# EAGLE schematic mini_project (EAGLE 9.5.2)
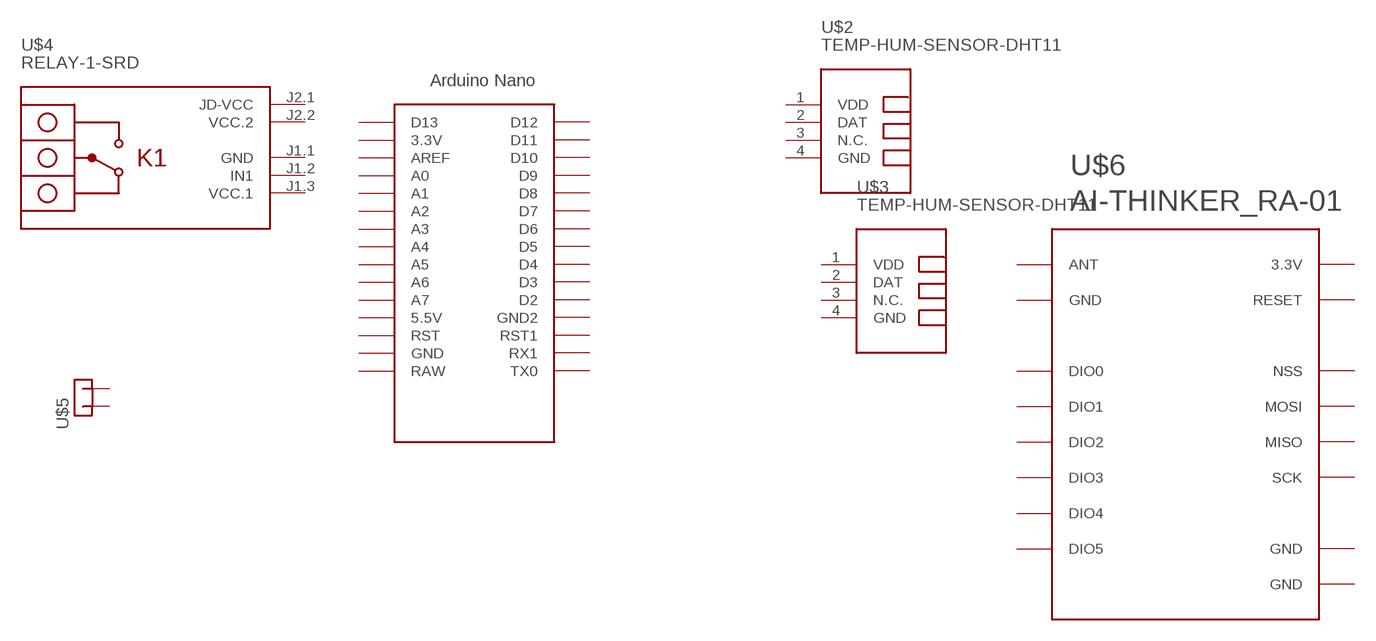
[diagram p0: schematic, sheet 1]

## Parts
U$1  NANO  [NANO]
U$2  TEMP-HUM-SENSOR-DHT11  [TEMP-HUM-SENSOR-DHT11]
U$3  TEMP-HUM-SENSOR-DHT11  [TEMP-HUM-SENSOR-DHT11]
U$4  RELAY-1-SRD  [RELAY-1-SRD]
U$5  -CON2  [CON2]
U$6  AI-THINKER_RA-01  [AI-THINKER_RA-01]
Unconnected: U$1.3.3V U$1.5V(5.5V) U$1.A0 U$1.A1 U$1.A2 U$1.A3 U$1.A4 U$1.A5 U$1.A6 U$1.A7 U$1.AREF U$1.D2 U$1.D3 U$1.D4 U$1.D5 U$1.D6 U$1.D7 U$1.D8 U$1.D9 U$1.D10 U$1.D11 U$1.D12 U$1.D13 U$1.GND U$1.GND1(GND2) U$1.ICSP1 U$1.ICSP2 U$1.ICSP3 U$1.ICSP4 U$1.ICSP5 U$1.ICSP6 U$1.RAW U$1.RST U$1.RST1 U$1.RX1 U$1.TX0 U$2.2(DAT) U$2.3(N.C.) U$3.2(DAT) U$3.3(N.C.) U$4.J1.2(IN1) U$4.J2.1(JD-VCC) U$5.P$1 U$5.P$2 U$6.P$1(ANT) U$6.P$2(GND) U$6.P$3(3.3V) U$6.P$4(RESET) U$6.P$5(DIO0) U$6.P$6(DIO1) U$6.P$7(DIO2) U$6.P$8(DIO3) U$6.P$9(GND) U$6.P$10(DIO4) U$6.P$11(DIO5) U$6.P$12(SCK) U$6.P$13(MISO) U$6.P$14(MOSI) U$6.P$15(NSS) U$6.P$16(GND)

## Power pins joined to a net without a drawn wire
GND: U$2.4(GND) U$3.4(GND) U$4.J1.1(GND)
VCC.1: U$4.J1.3(VCC.1)
VCC.2: U$4.J2.2(VCC.2)
VDD: U$2.1(VDD) U$3.1(VDD)

## Library data of the parts
U$1 = Arduino-clone:NANO: Arduino Nano
U$2 U$3 = diy-modules:TEMP-HUM-SENSOR-DHT11: DHT11 - digital humidity & temperature sensor DHT11 datasheet available here: https://akizukidenshi.com/download/ds/aosong/DHT11.pdf Click here to find device on ebay.com <http://www.ebay.com/sch/dht11+digital+sensor>
U$4 = diy-modules:RELAY-1-SRD: 1-Channel Relay Module based on SRD-05VDC-SL-C relays Click here to find device on ebay.com <http://www.ebay.com/sch/one+channel+isolated+relay+5v>
U$5 = tango:-CON2
U$6 = LoRa_modules:AI-THINKER_RA-01